# Altium schematic sheet main.SchDoc
size A4; SheetNumber: 1; SheetTotal: 1
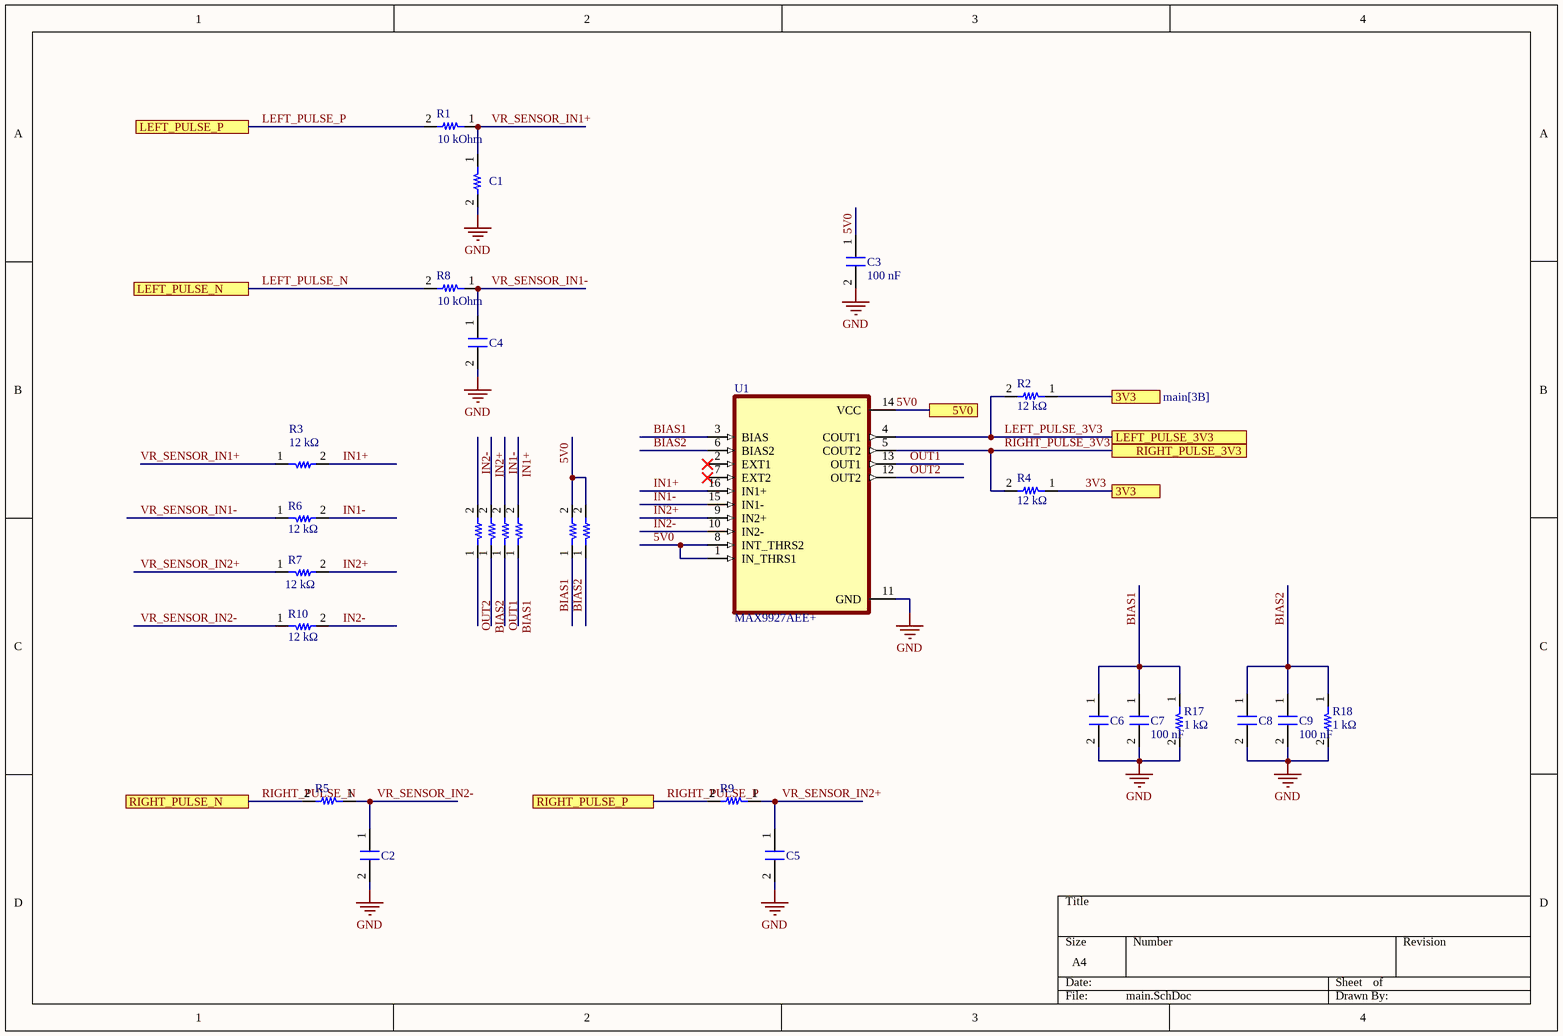
[diagram p0: main.SchDoc]

## Parts
C1  Resistor_0402  [0402_fp]  (value not drawn)
C2  Capacitor_0402  [0402_fp]  (value not drawn)
C3  value 100 nF  [0402_fp]  (hidden comment: Capacitor_0402)
C4  Capacitor_0402  [0402_fp]  (value not drawn)
C5  Capacitor_0402  [0402_fp]  (value not drawn)
C6  Capacitor_0603  [0603_FP]  (value not drawn)
C7  value 100 nF  [0402_fp]  (hidden comment: Capacitor_0402)
C8  Capacitor_0603  [0603_FP]  (value not drawn)
C9  value 100 nF  [0402_fp]  (hidden comment: Capacitor_0402)
R1  value 10 kOhm  [0402_fp]  (hidden comment: Resistor_0402)
R2  value 12 kΩ  [0402_fp]  (hidden comment: Resistor_0402)
R3  value 12 kΩ  [0402_fp]  (hidden comment: Resistor_0402)
R4  value 12 kΩ  [0402_fp]  (hidden comment: Resistor_0402)
R5  Resistor_0402  [0402_fp]  (value not drawn)
R6  value 12 kΩ  [0402_fp]  (hidden comment: Resistor_0402)
R7  value 12 kΩ  [0402_fp]  (hidden comment: Resistor_0402)
R8  value 10 kOhm  [0402_fp]  (hidden comment: Resistor_0402)
R9  Resistor_0402  [0402_fp]  (value not drawn)
R10  value 12 kΩ  [0402_fp]  (hidden comment: Resistor_0402)
R11  Resistor_0402  [0402_fp]  (value not drawn)
R12  Resistor_0402  [0402_fp]  (value not drawn)
R13  Resistor_0402  [0402_fp]  (value not drawn)
R14  Resistor_0402  [0402_fp]  (value not drawn)
R15  Resistor_0402  [0402_fp]  (value not drawn)
R16  Resistor_0402  [0402_fp]  (value not drawn)
R17  value 1 kΩ  [0402_fp]  (hidden comment: Resistor_0402)
R18  value 1 kΩ  [0402_fp]  (hidden comment: Resistor_0402)
U1  MAX9927AEE+  [SOP63P602X175-16N]

## Ports
3V3 (see main[3B]), 5V0, LEFT_PULSE_3V3, LEFT_PULSE_N, LEFT_PULSE_P, RIGHT_PULSE_3V3, RIGHT_PULSE_N, RIGHT_PULSE_P

## Nets
GND: C1.2 C2.2 C3.2 C4.2 C5.2 C6.2 C7.2 C8.2 C9.2 R17.2 R18.2 U1.11(GND)
3V3: R2.1 R4.1 ; port 3V3
5V0: C3.1 R15.2 R16.2 U1.1(IN_THRS1) U1.8(INT_THRS2) U1.14(VCC) ; port 5V0
BIAS1: C6.1 C7.1 R14.1 R15.1 R17.1 U1.3(BIAS)
BIAS2: C8.1 C9.1 R12.1 R16.1 R18.1 U1.6(BIAS2)
IN1+: R3.2 R14.2 U1.16(IN1+)
IN1-: R6.2 R13.2 U1.15(IN1-)
IN2+: R7.2 R12.2 U1.9(IN2+)
IN2-: R10.2 R11.2 U1.10(IN2-)
LEFT_PULSE_3V3: R2.2 U1.4(COUT1) ; port LEFT_PULSE_3V3
LEFT_PULSE_N: R8.2 ; port LEFT_PULSE_N
LEFT_PULSE_P: R1.2 ; port LEFT_PULSE_P
OUT1: R13.1 U1.13(OUT1)
OUT2: R11.1 U1.12(OUT2)
RIGHT_PULSE_3V3: R4.2 U1.5(COUT2) ; port RIGHT_PULSE_3V3
RIGHT_PULSE_N: R5.2 ; port RIGHT_PULSE_N
RIGHT_PULSE_P: R9.2 ; port RIGHT_PULSE_P
VR_SENSOR_IN1+: C1.1 R1.1 R3.1
VR_SENSOR_IN1-: C4.1 R6.1 R8.1
VR_SENSOR_IN2+: C5.1 R7.1 R9.1
VR_SENSOR_IN2-: C2.1 R5.1 R10.1

Not connected (* = marked no-connect by the designer): U1 2(EXT1)* 7(EXT2)*

## Library data of the parts
C1 R5 R9 = Resistor_0402: Value: 0 Ohm; Format: 0402; Package: 0402
C2 C4 C5 = Capacitor_0402: Value: 1 nF; Format: 0402; Package: 0402
C3 C7 C9 = Capacitor_0402: Format: 0402; Package: 0402
C6 C8 = Capacitor_0603: Value: 10 uF; Format: 0402; Package: 0402
R1-R4 R6-R8 R10 R17 R18 = Resistor_0402: Format: 0402; Package: 0402
R11-R14 = Resistor_0402: Value: 12 kΩ; Format: 0402; Package: 0402
R15 R16 = Resistor_0402: Value: 1 kΩ; Format: 0402; Package: 0402
U1 = MAX9927AEE+: Variable-Reluctance Sensor Interface with Differential Input and Adaptive Peak Threshold; MF: Analog Devices; SnapEDA_Link: https://www.snapeda.com/parts/MAX9927AEE+/Analog+Devices/view-part/?ref=snap; Package: QSOP-16 Maxim; Value: *; MP: MAX9927AEE+; Check_prices: https://www.snapeda.com/parts/MAX9927AEE+/Analog+Devices/view-part/?ref=eda